# Altium project vestibular_vampire.PrjPcb (part 2 of 3)
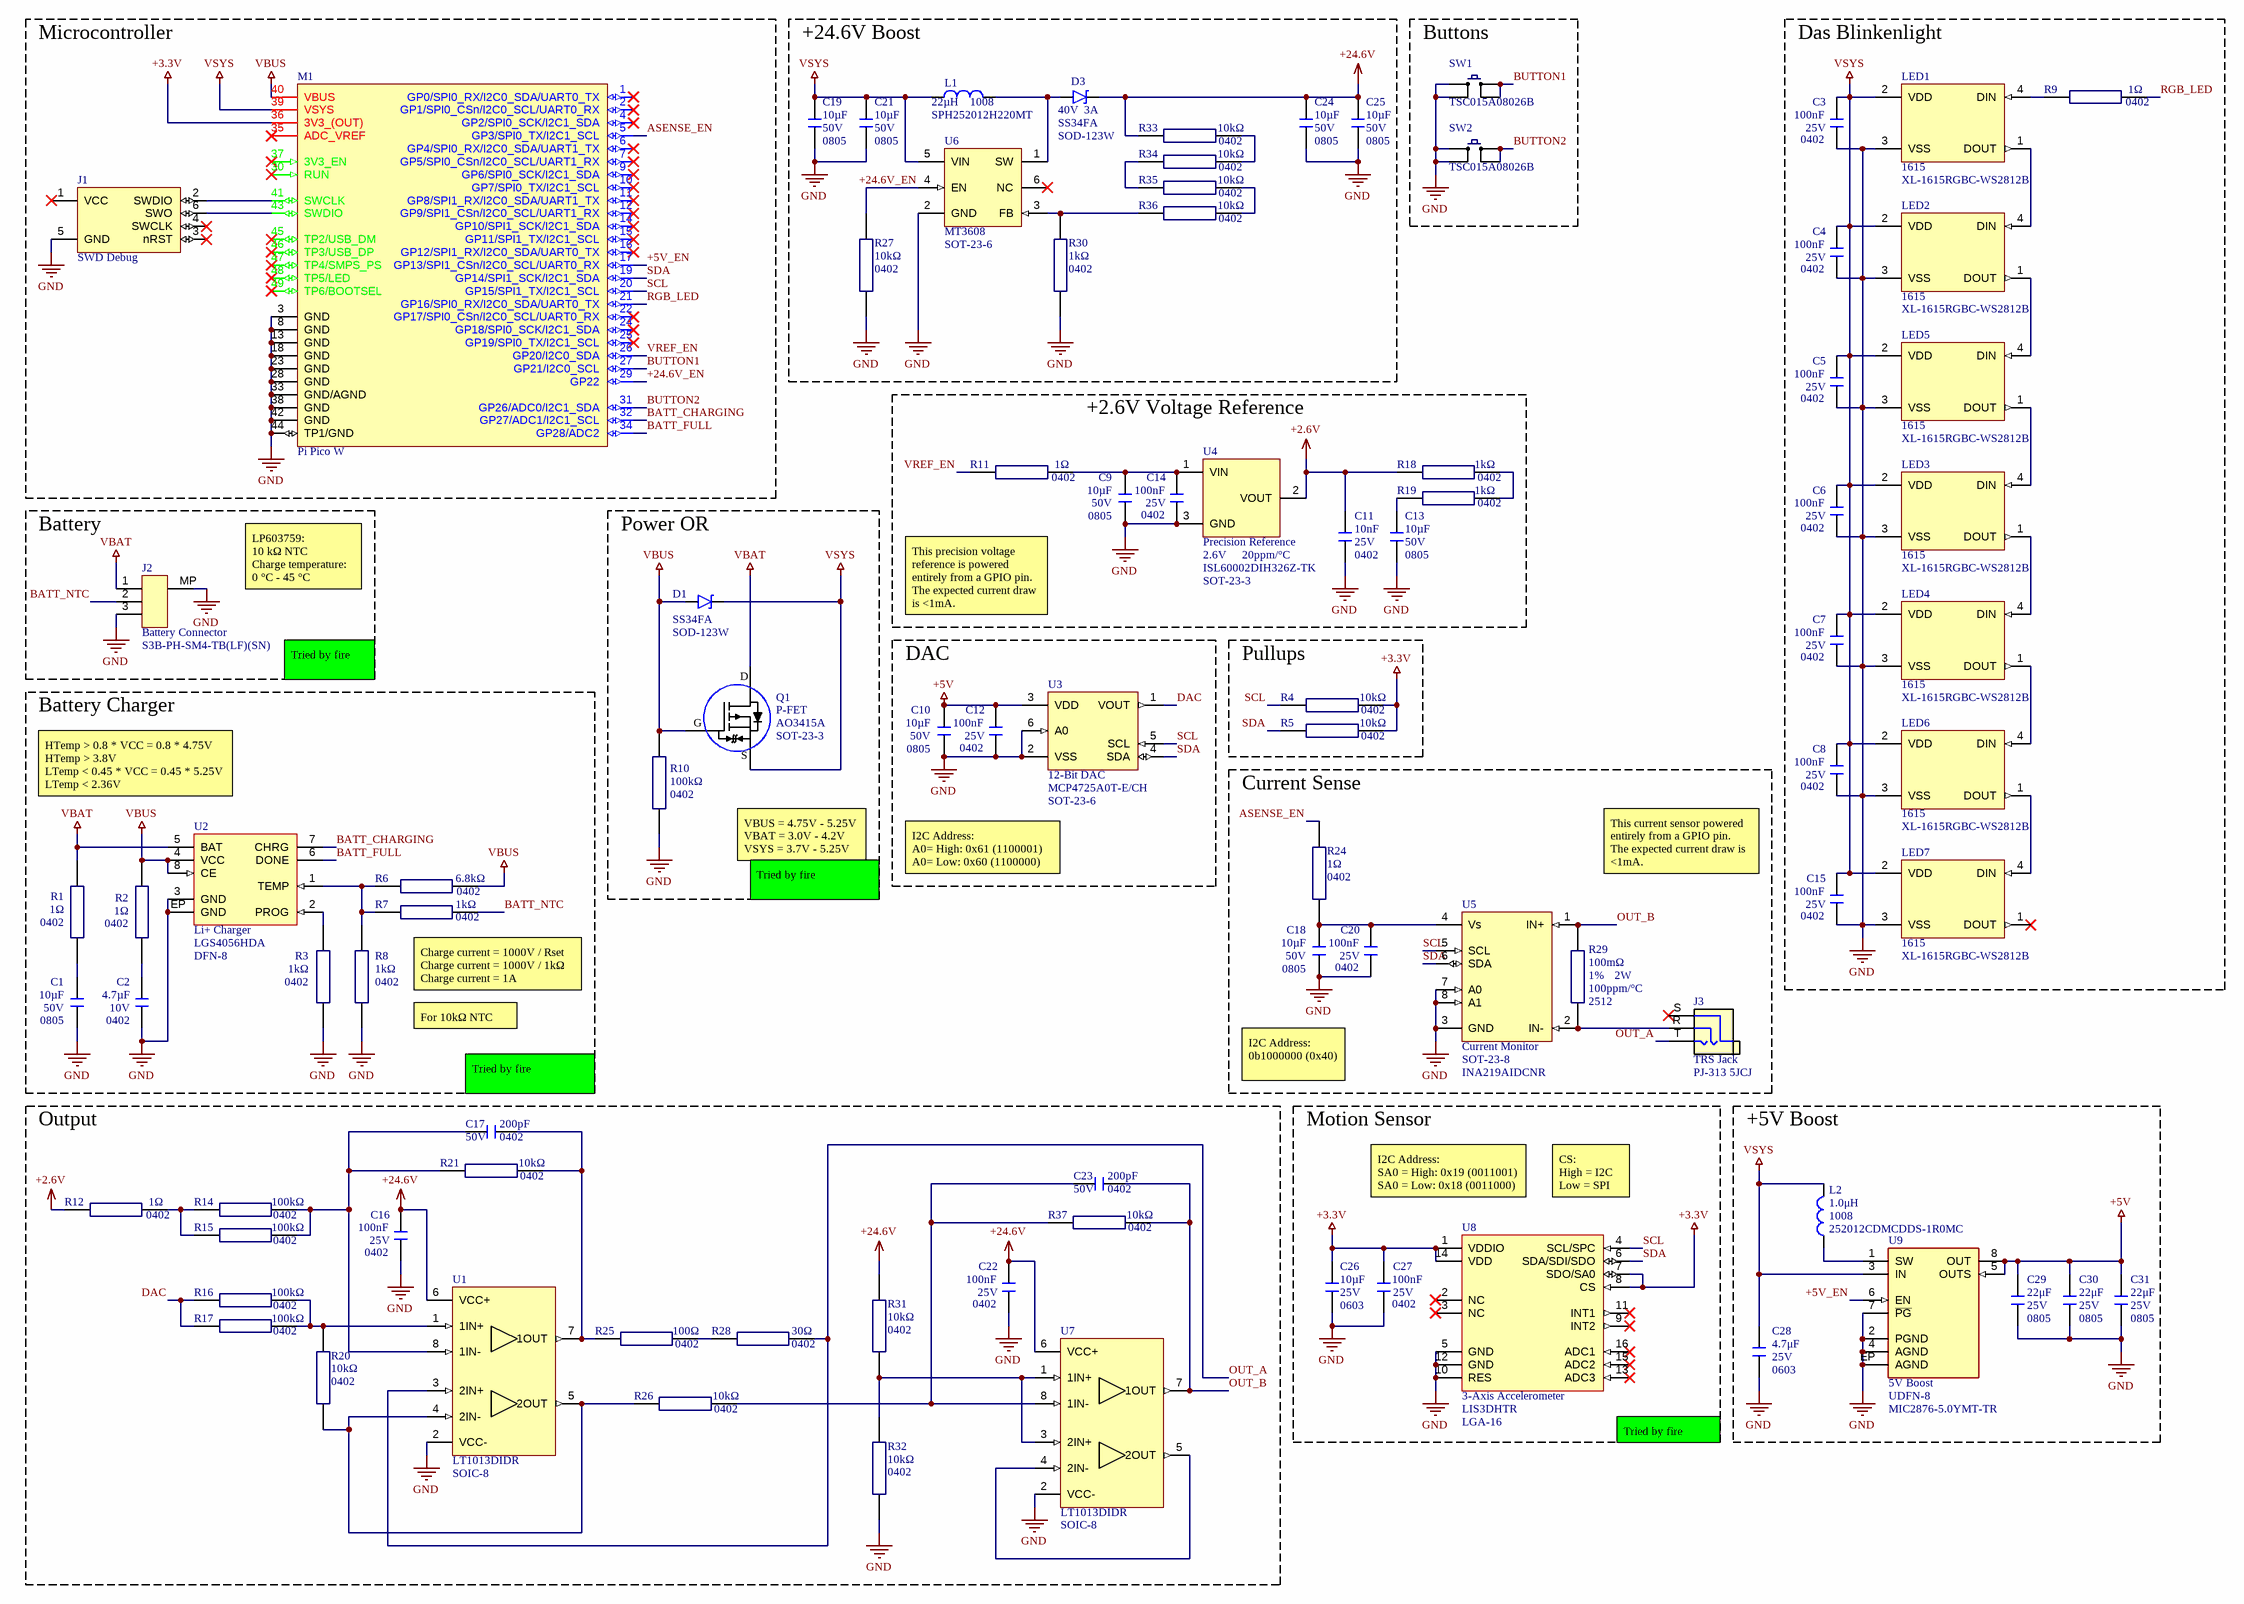
[diagram p1: vestibular_vampire.SchDoc]

## Sheet vestibular_vampire.SchDoc: Vestibular Vampire (continued)
### Library data of the parts
C1 C9 C10 C13 C18 C19 C21 C24 C25 = GRM21BR61H106KE43L: 10 μF, 50 V, X5R, 0805 Chip capacitor; Manufacturer: Murata; Manufacturer Lifecycle Status: IN PRODUCTION; Dielectric Material: Ceramic; Tolerance: 10%; Supplier 1: LCSC; Manufacturer Part Number: GRM21BR61H106KE43L; RoHS: Compliant; Category: Ceramic Capacitors; Stock 1: 4345800; Pricing 1: 10=0.4708, 10=0.0567, 10=0.514, 10=0.0644, 100=0.3794, 100=0.0457, 100=0.4142, 100=0.0519, 300=0.3327, 300=0.0401, 300=0.3631, 300=0.0455, 3000=0.2815, 3000=0.0339, 3000=0.3073, 3000=0.0385, 6000=0.2676, 6000=0.0323, 6000=0.2921, 6000=0.0366, 9000=0.2588, 9000=0.0312, 9000=0.2825, 9000=0.0354 (CNY); Dielectric: X5R; Height: 1.25mm; Length: 2mm; Lifecycle Status: Production; Material: Ceramic; Max Operating Temperature: 85°C; Min Operating Temperature: -55°C; Mounting Technology: Surface Mount; Number of Terminals: 2; REACH SVHC: Yes; Thickness: 1.25mm; Voltage Rating (DC): 50V; Width: 1.25mm; ComponentLink1URL: https://datasheet.octopart.com:443/GRM21BR61H106KE43L-Murata-datasheet-155345082.pdf?src-supplier=Newark; ComponentLink1Description: https://datasheet.octopart.com:443/GRM21BR61H106KE43L-Murata-datasheet-155345082.pdf?src-supplier=Newark; ComponentLink2URL: https://datasheet.octopart.com:443/GRM21BR61H106KE43L-Murata-datasheet-141278272.pdf?src-supplier=Geoflip; ComponentLink2Description: https://datasheet.octopart.com:443/GRM21BR61H106KE43L-Murata-datasheet-141278272.pdf?src-supplier=Geoflip; ComponentLink3URL: https://datasheet.octopart.com:443/GRM21BR61H106KE43L-Murata-datasheet-165579666.pdf?src-supplier=TME; ComponentLink3Description: https://datasheet.octopart.com:443/GRM21BR61H106KE43L-Murata-datasheet-165579666.pdf?src-supplier=TME; ComponentLink4URL: https://datasheet.octopart.com:443/GRM21BR61H106KE43L-Murata-datasheet-140707579.pdf?src-supplier=Ciiva; ComponentLink4Description: https://datasheet.octopart.com:443/GRM21BR61H106KE43L-Murata-datasheet-140707579.pdf?src-supplier=Ciiva; ComponentLink5URL: https://datasheet.octopart.com:443/GRM21BR61H106KE43L-Murata-datasheet-138744880.pdf?src-supplier=Ciiva; ComponentLink5Description: https://datasheet.octopart.com:443/GRM21BR61H106KE43L-Murata-datasheet-138744880.pdf?src-supplier=Ciiva; ComponentLink6URL: https://datasheet.octopart.com/GRM21BR61H106KE43L-Murata-datasheet-12515295.pdf; ComponentLink6Description: https://datasheet.octopart.com/GRM21BR61H106KE43L-Murata-datasheet-12515295.pdf; ComponentLink7URL: https://datasheet.octopart.com/GRM21BR61H106KE43L-Murata-datasheet-12510076.pdf; ComponentLink7Description: https://datasheet.octopart.com/GRM21BR61H106KE43L-Murata-datasheet-12510076.pdf; ComponentLink8URL: https://datasheet.octopart.com/GRM21BR61H106KE43L-Murata-datasheet-11978611.pdf; ComponentLink8Description: https://datasheet.octopart.com/GRM21BR61H106KE43L-Murata-datasheet-11978611.pdf; ComponentLink9URL: https://datasheet.octopart.com/GRM21BR61H106KE43L-Murata-datasheet-10025737.pdf; ComponentLink9Description: https://datasheet.octopart.com/GRM21BR61H106KE43L-Murata-datasheet-10025737.pdf; ComponentLink10URL: https://datasheet.octopart.com/GRM21BR61H106KE43L-Murata-datasheet-8819587.pdf; ComponentLink10Description: https://datasheet.octopart.com/GRM21BR61H106KE43L-Murata-datasheet-8819587.pdf; ComponentLink11URL: http://sigma.octopart.com:80/reach_statement/Murata-company-16.pdf?src-supplier=Compliance+Statements; ComponentLink11Description: http://sigma.octopart.com:80/reach_statement/Murata-company-16.pdf?src-supplier=Compliance+Statements; Supplier Part Number 1: C440198
C2 = CL05A475KP5NRNC: 4.7 µF, 10 V, X5R, 0402 Chip capacitor; Manufacturer: Samsung; house_part_number: C-4.7uF-0402-002; Material: Ceramic; Tolerance: 10%; RoHS: Yes; Category: Ceramic Capacitors; Min Operating Temperature: -55°C; Max Operating Temperature: 85°C; Packaging: Tape and Reel; RoHS Compliant: Yes; ComponentLink1URL: https://datasheet.ciiva.com/25724/cl05a475kp5nrnc-25724404.pdf?src-supplier=Digikey; ComponentLink1Description: https://datasheet.ciiva.com/25724/cl05a475kp5nrnc-25724404.pdf?src-supplier=Digikey; ComponentLink2URL: https://datasheet.ciiva.com/29198/458873-da-01-en-vs-kondensator-0402-29198304.pdf?src-supplier=Conrad; ComponentLink2Description: https://datasheet.ciiva.com/29198/458873-da-01-en-vs-kondensator-0402-29198304.pdf?src-supplier=Conrad; Manufacturer Part Number: CL05A475KP5NRNC; Stock: 606274; Pricing: 1=0.28, 10=0.184, 50=0.129, 100=0.1042, 500=0.0774, 1000=0.06772, 2500=0.0645, 5000=0.05966 (USD); Mounting Technology: Surface Mount; Case Code (Metric): 1005; Case Code (Imperial): 0402; Package Quantity: 1; Dielectric: X5R; Series: CL; Construction: Flat; Length: 1mm; Width: 0.02inch; Height: 0.5mm; Thickness: 0.022inch; Depth: 0.5mm; Radiation Hardening: No; Lead Free: Lead Free; Supplier Part Number 1: 1276-1480-1-ND; Supplier 1: Digikey
C3-C8 C12 C14-C16 C20 C22 C27 = GRM155R71E104KE14D: 100 nF, 25 V, X7R, 0402 Chip capacitor; Manufacturer: Murata; house_part_number: C-100nF-0402-002; Dielectric Material: Ceramic; Tolerance: 10%; Supplier 1: Digi-Key; Supplier Part Number 1: 490-10698-1-ND; RoHS: Yes; Category: Ceramic Capacitors; Pricing 1: 1=0.10000, 10=0.02700, 50=0.01460, 100=0.01190, 500=0.00848, 1000=0.00666, 2500=0.00605, 5000=0.00557 (USD); Mount: Surface Mount; Case/Package: 0402; Case Code (Metric): 1005; Weight: 0.000212oz; Min Operating Temperature: -55°C; Max Operating Temperature: 125°C; Packaging: Tape and Reel; Voltage Rating: 25V; Dielectric: X7R; Termination: SMD/SMT; Resistor Type: Ceramic; Voltage Rating (DC): 25V; Package Quantity: 10000; Length: 1mm; Width: 0.02inch; Height: 0.5mm; Thickness: 0.022inch; Depth: 0.5mm; REACH SVHC: Unknown; Lead Free: Lead Free; RoHS Compliant: Yes; ComponentLink1URL: http://www.farnell.com/datasheets/1872206.pdf?src-supplier=Farnell; ComponentLink1Description: http://www.farnell.com/datasheets/1872206.pdf?src-supplier=Farnell; ComponentLink2URL: http://components.arrow.com/part/dataview/0323_06361249?src-supplier=Arrow+Europe; ComponentLink2Description: http://components.arrow.com/part/dataview/0323_06361249?src-supplier=Arrow+Europe; ComponentLink3URL: http://uk.rs-online.com/webdocs/144c/0900766b8144c113.pdf?src-supplier=RSComponents; ComponentLink3Description: http://uk.rs-online.com/webdocs/144c/0900766b8144c113.pdf?src-supplier=RSComponents; ComponentLink4URL: http://www.farnell.com/datasheets/2048008.pdf?src-supplier=Farnell; ComponentLink4Description: http://www.farnell.com/datasheets/2048008.pdf?src-supplier=Farnell; ComponentLink5URL: http://www.mouser.com/ds/2/281/c02e-2905.pdf?src-supplier=Mouser; ComponentLink5Description: http://www.mouser.com/ds/2/281/c02e-2905.pdf?src-supplier=Mouser; ComponentLink6URL: http://www.farnell.com/datasheets/2048008.pdf?src-supplier=Newark; ComponentLink6Description: http://www.farnell.com/datasheets/2048008.pdf?src-supplier=Newark; ComponentLink7URL: https://search.murata.co.jp/Ceramy/image/img/A01X/G101/ENG/GRM155R71E104KE14-01.pdf?src-supplier=Digi-Key; ComponentLink7Description: https://search.murata.co.jp/Ceramy/image/img/A01X/G101/ENG/GRM155R71E104KE14-01.pdf?src-supplier=Digi-Key; ComponentLink8URL: http://www.farnell.com/datasheets/2048008.pdf?src-supplier=Element14; ComponentLink8Description: http://www.farnell.com/datasheets/2048008.pdf?src-supplier=Element14; ComponentLink9URL: http://psearch.en.murata.com/capacitor/product/GRM155R71E104KE14%23.pdf?src-supplier=Avnet; ComponentLink9Description: http://psearch.en.murata.com/capacitor/product/GRM155R71E104KE14%23.pdf?src-supplier=Avnet; Manufacturer Part Number: GRM155R71E104KE14D
C11 = CL05B103KA5NNNC: 10 nF, 25 V, X7R, 0402 Chip capacitor; Manufacturer: Samsung; house_part_number: C-10nF-0402-002; Tolerance: 10%; Supplier 1: Digi-Key; Supplier Part Number 1: 1276-1057-2-ND; RoHS: Yes; Category: Ceramic Capacitors; Stock 1: 2318300; Pricing 1: 10000=0.00328, 20000=0.00312, 30000=0.00297, 50000=0.00266, 100000=0.00215, 250000=0.00195 (USD); Mount: Surface Mount; Case/Package: 0402; Case Code (Metric): 1005; Contact Plating: Tin; Min Operating Temperature: -55°C; Max Operating Temperature: 125°C; Packaging: Tape and Reel; Package Quantity: 1; Dielectric: X7R; Series: CL; Construction: Flat; Length: 1mm; Width: 0.02inch; Height: 0.5mm; Thickness: 0.022inch; Depth: 0.5mm; Radiation Hardening: No; RoHS Compliant: Yes; ComponentLink1URL: https://datasheet.ciiva.com/15195/getdatasheetpartid-358612-15195635.pdf?src-supplier=Verical; ComponentLink1Description: https://datasheet.ciiva.com/15195/getdatasheetpartid-358612-15195635.pdf?src-supplier=Verical; ComponentLink2URL: https://datasheet.ciiva.com/16740/cl05b104kq5nnnc-16740683.pdf?src-supplier=Future+Electronics; ComponentLink2Description: https://datasheet.ciiva.com/16740/cl05b104kq5nnnc-16740683.pdf?src-supplier=Future+Electronics; Manufacturer Part Number: CL05B103KA5NNNC
C17 C23 = GRT1555C1H201FA02D: 200 pF, 50V, C0G, 0402 Chip capacitor; Manufacturer: Murata; Manufacturer Lifecycle Status: IN PRODUCTION; Dielectric Material: Ceramic; Temperature Coefficient: 30ppm/°C; Tolerance: 1%; Supplier 1: LCSC; Manufacturer Part Number: GRT1555C1H201FA02D; RoHS: Compliant; Category: Ceramic Capacitors; Stock 1: 4350; Pricing 1: 50=0.0995, 50=0.012, 50=0.1086, 50=0.0136, 500=0.0783, 500=0.0095, 500=0.0854, 500=0.0107, 1500=0.0666, 1500=0.0081, 1500=0.0727, 1500=0.0091, 10000=0.0593, 10000=0.0072, 10000=0.0647, 10000=0.0081, 20000=0.0534, 20000=0.0065, 20000=0.0583, 20000=0.0073, 50000=0.0505, 50000=0.0061, 50000=0.0551, 50000=0.0069 (CNY); Height: 500µm; Length: 1mm; Lifecycle Status: Production; Material: Ceramic; Max Operating Temperature: 125°C; Min Operating Temperature: -55°C; Mounting Technology: Surface Mount; Number of Terminals: 2; REACH SVHC: Yes; Thickness: 500µm; Voltage Rating (DC): 50V; Width: 500µm; ComponentLink1URL: http://sigma.octopart.com:80/reach_statement/Murata-company-16.pdf?src-supplier=Compliance+Statements; ComponentLink1Description: http://sigma.octopart.com:80/reach_statement/Murata-company-16.pdf?src-supplier=Compliance+Statements; Supplier Part Number 1: C3896876
C26 = CL10A106MA8NRNC: 10 µF, 25 V, X5R, 0603 Chip capacitor; Manufacturer: Samsung; house_part_number: C-10uF-0603-002; Tolerance: 20%; Material: 4241ConductorMaterial; RoHS: Yes; Category: Ceramic Capacitors; Case Code (Metric): 1608; Min Operating Temperature: -55°C; Max Operating Temperature: 85°C; Packaging: Cut Tape; RoHS Compliant: Yes; ComponentLink1URL: https://datasheet.ciiva.com/25766/cl10a106ma8nrnc-25766562.pdf?src-supplier=Digikey; ComponentLink1Description: https://datasheet.ciiva.com/25766/cl10a106ma8nrnc-25766562.pdf?src-supplier=Digikey; Manufacturer Part Number: CL10A106MA8NRNC; Case Code (Imperial): 0603; Stock: 632000; Pricing: 4000=0.0511, 8000=0.046, 12000=0.0434, 28000=0.0413, 100000=0.0356 (USD); Mounting Technology: Surface Mount; Series: CL; Height: 900um; Lead Free: Lead Free; Supplier Part Number 1: CL10A106MA8NRNC; Supplier 1: Arrow Electronics
C28 = C1608X5R1E475K080AC: 4.7 μF, 25 V, X7R, 0603 Chip capacitor; Manufacturer: TDK; Dielectric Material: Ceramic; Tolerance: 10%; Dielectric: X5R; Supplier: Digikey; Supplier Part Number: 445-9050-1-ND; Manufacturer Part Number: C1608X5R1E475K080AC; RoHS: Yes; Category: Ceramic Capacitors; Stock: 1983872; Pricing: 1=0.16, 10=0.104, 50=0.0732, 100=0.0592, 500=0.04396, 1000=0.03847, 4000=0.03389, 8000=0.03225 (USD); Mounting Technology: Surface Mount; Case Code (Metric): 1608; Case Code (Imperial): 0603; Weight: 7.1E-05oz; Material: Ceramic; Min Operating Temperature: -55°C; Max Operating Temperature: 85°C; Packaging: Tape and Reel; Package Quantity: 4000; Voltage Rating (DC): 25V; Termination: SMD/SMT; Series: C; Construction: Flat; Length: 1.6mm; Width: 0.031inch; Height: 0.8mm; Thickness: 0.039inch; Depth: 0.8mm; Lead Free: Lead Free; RoHS Compliant: Yes; Reach SVHC Compliant: Unknown; ComponentLink1URL: https://datasheet.ciiva.com/48671/mlcc-commercial-general-en-48671304.pdf?src-supplier=Avnet; ComponentLink1Description: https://datasheet.ciiva.com/48671/mlcc-commercial-general-en-48671304.pdf?src-supplier=Avnet; ComponentLink2URL: https://datasheet.ciiva.com/24216/mlcc-commercial-general-en-24216326.pdf?src-supplier=Mouser; ComponentLink2Description: https://datasheet.ciiva.com/24216/mlcc-commercial-general-en-24216326.pdf?src-supplier=Mouser; ComponentLink3URL: https://datasheet.ciiva.com/48587/6print-detail-pdf-phplangenpart-noc1608x5r1e475k080acimp-unit-xmhz-48587141.pdf?src-supplier=Onlinecomponents.com; ComponentLink3Description: https://datasheet.ciiva.com/48587/6print-detail-pdf-phplangenpart-noc1608x5r1e475k080acimp-unit-xmhz-48587141.pdf?src-supplier=Onlinecomponents.com
C29-C31 = GRT21BR61E226ME13L: 22 μF, 25 V, X5R, 0805 Chip capacitor; Manufacturer: Murata; Dielectric Material: Ceramic; Multilayer: Yes; Tolerance  (fill in as +-): 20%; Reference Standard: AEC-Q200; Supplier 1: Digi-Key; RoHS: Yes; Category: Ceramic Capacitors; Stock 1: 1983731; Pricing 1: 1=0.48, 10=0.338, 50=0.2558, 100=0.2228, 500=0.16508, 1000=0.14031 (USD); Mounting Technology: Surface Mount; Pins: 2; Package Shape: Rectangular; Terminal Finish: Nickel; Min Operating Temperature: -55°C; Max Operating Temperature: 85°C; JESD-609 Code: e3; Capacitor Type: Ceramic; Packaging: Tape and Reel; Tolerance (fill in as +-): 20%; Temperature Characteristics Code: X5R; Termination: Wraparound; Reach SVHC Compliant: Yes; RoHS Compliant: Yes; ComponentLink1URL: https://datasheet.ciiva.com:443/pdfs/VipMasterIC/IC/MURE/MURE-S-A0004410517/MURE-S-A0004413512-1.pdf?src-supplier=IHS+Markit; ComponentLink1Description: https://datasheet.ciiva.com:443/pdfs/VipMasterIC/IC/MURE/MURE-S-A0004410517/MURE-S-A0004413512-1.pdf?src-supplier=IHS+Markit; ComponentLink2URL: http://search.murata.co.jp/Ceramy/image/img/A01X/G101/ENG/GRT21BR61E226ME13-01.pdf?src-supplier=Digi-Key; ComponentLink2Description: http://search.murata.co.jp/Ceramy/image/img/A01X/G101/ENG/GRT21BR61E226ME13-01.pdf?src-supplier=Digi-Key; Manufacturer Part Number: GRT21BR61E226ME13L; Supplier Part Number 1: 490-12389-1-ND
D1 = SS34FA: 40 V, 3 A Schottky Rectifier, SOD-123FA; Manufacturer: ON Semiconductor / Fairchild; house_part_number: D-SCHOTTKY-3A-SOD123F-002; Max Forward Surge Current (Ifsm): 80A; Max Repetitive Reverse Voltage (Vrrm): 40V; Average Rectified Current: 3A; Element Configuration: Single; RoHS: Yes; Category: Schottky Diodes; RoHS Compliant: Yes; ComponentLink1URL: http://www.farnell.com/datasheets/2552647.pdf?src-supplier=Farnell; ComponentLink1Description: http://www.farnell.com/datasheets/2552647.pdf?src-supplier=Farnell; ComponentLink2URL: http://www.mouser.com/ds/2/149/SS34FA-1012641.pdf?src-supplier=Mouser; ComponentLink2Description: http://www.mouser.com/ds/2/149/SS34FA-1012641.pdf?src-supplier=Mouser; ComponentLink3URL: http://www.farnell.com/datasheets/2552647.pdf?src-supplier=Element14; ComponentLink3Description: http://www.farnell.com/datasheets/2552647.pdf?src-supplier=Element14; ComponentLink4URL: http://www.farnell.com/datasheets/2552647.pdf?src-supplier=Newark; ComponentLink4Description: http://www.farnell.com/datasheets/2552647.pdf?src-supplier=Newark; ComponentLink5URL: https://www.fairchildsemi.com/datasheets/SS/SS34FA.pdf?src-supplier=Digikey; ComponentLink5Description: https://www.fairchildsemi.com/datasheets/SS/SS34FA.pdf?src-supplier=Digikey; ComponentLink6URL: https://www.onsemi.com/pub/Collateral/SS36FA-D.PDF?src-supplier=Digikey; ComponentLink6Description: https://www.onsemi.com/pub/Collateral/SS36FA-D.PDF?src-supplier=Digikey; ComponentLink7URL: https://datasheet.octopart.com/SS34FA-ON-Semiconductor-datasheet-137713515.pdf?src-supplier=TME; ComponentLink7Description: https://datasheet.octopart.com/SS34FA-ON-Semiconductor-datasheet-137713515.pdf?src-supplier=TME; Manufacturer Part Number: SS34FA; Supplier 1: LCSC; Supplier Part Number 1: C719833; Supplier: Avnet; Supplier Part Number: 01AC9736; Stock: 2402; Pricing: 1=0.469, 25=0.4, 50=0.341, 100=0.281, 250=0.251 (USD); Mounting Technology: Surface Mount; Weight: 0.019g; Packaging: Cut Tape; Max Reverse Voltage (DC): 40V; Series: Automotive, AEC-Q101
D3 = SS34FA: 40 V, 3 A Schottky Rectifier, SOD-123FA; Manufacturer: ON Semiconductor / Fairchild; house_part_number: D-SCHOTTKY-3A-SOD123F-002; Max Forward Surge Current (Ifsm): 80A; Element Configuration: Single; RoHS: Yes; Category: Schottky Diodes; RoHS Compliant: Yes; ComponentLink1URL: http://www.farnell.com/datasheets/2552647.pdf?src-supplier=Farnell; ComponentLink1Description: http://www.farnell.com/datasheets/2552647.pdf?src-supplier=Farnell; ComponentLink2URL: http://www.mouser.com/ds/2/149/SS34FA-1012641.pdf?src-supplier=Mouser; ComponentLink2Description: http://www.mouser.com/ds/2/149/SS34FA-1012641.pdf?src-supplier=Mouser; ComponentLink3URL: http://www.farnell.com/datasheets/2552647.pdf?src-supplier=Element14; ComponentLink3Description: http://www.farnell.com/datasheets/2552647.pdf?src-supplier=Element14; ComponentLink4URL: http://www.farnell.com/datasheets/2552647.pdf?src-supplier=Newark; ComponentLink4Description: http://www.farnell.com/datasheets/2552647.pdf?src-supplier=Newark; ComponentLink5URL: https://www.fairchildsemi.com/datasheets/SS/SS34FA.pdf?src-supplier=Digikey; ComponentLink5Description: https://www.fairchildsemi.com/datasheets/SS/SS34FA.pdf?src-supplier=Digikey; ComponentLink6URL: https://www.onsemi.com/pub/Collateral/SS36FA-D.PDF?src-supplier=Digikey; ComponentLink6Description: https://www.onsemi.com/pub/Collateral/SS36FA-D.PDF?src-supplier=Digikey; ComponentLink7URL: https://datasheet.octopart.com/SS34FA-ON-Semiconductor-datasheet-137713515.pdf?src-supplier=TME; ComponentLink7Description: https://datasheet.octopart.com/SS34FA-ON-Semiconductor-datasheet-137713515.pdf?src-supplier=TME; Manufacturer Part Number: SS34FA; Supplier 1: LCSC; Supplier Part Number 1: C719833; Supplier: Avnet; Supplier Part Number: 01AC9736; Stock: 2402; Pricing: 1=0.469, 25=0.4, 50=0.341, 100=0.281, 250=0.251 (USD); Mounting Technology: Surface Mount; Weight: 0.019g; Packaging: Cut Tape; Max Repetitive Reverse Voltage (Vrrm): 40V; Series: Automotive, AEC-Q101
J1 = TAG_CONN_CTX: Mates with TC-2030-CTX-NL; house_part_number: type-value-case-grade
J2 = S3B-PH-SM4-TB(LF)(SN): 3-Pin JST-PH connector, 2mm pitch, right-angle SMD; Manufacturer: JST; Current Rating: 2A; Voltage Rating: 100V; Contact Resistance: 10mR; Number of Poles: 3; Insulation Resistance: 1GR; Gender: Male; Connector Type: Header; Supplier 1: LCSC; RoHS: Yes; Category: Headers and Wire Housings; Stock 1: 30540; Pricing 1: 5=0.223, 50=0.1765, 150=0.1538, 1000=0.1202, 2000=0.1152, 5000=0.1122 (USD); Mounting Technology: Surface Mount; Contact Material: Copper Alloy,Tin,Bronze,Brass; Contact Plating: Tin,Copper; Color: Natural,White; Housing Color: Beige; Housing Material: Polyamide; Material: Polyamide; Contact Shape: Square; Insulation Material: Nylon; Insulation Color: Natural; Contact Finish - Mating: TIN; Weight: 28.349523g; Min Operating Temperature: -25°C; Max Operating Temperature: 85°C; Number of Rows: 1; Voltage Rating (AC): 100V; Max Current Rating: 2A; Packaging: Tape and Reel; Number of Positions: 3; Termination: Solder; Fastening Type: Detent; Number of Contacts: 3; Working Voltage: 100V; Max Voltage Rating (AC): 100V; Max Voltage Rating (DC): 100V; Orientation: Right Angle; Contact Type: Male Pin; Voltage Rating (DC): 100V; Length: 9.9mm; Width: 5mm; Height: 9.4mm; Lead Pitch: 2mm; Pitch: 2mm; Contact Mating Length: 0.13inch; Depth: 7.6mm; Reach SVHC Compliant: No; Flammability Rating: UL94 V-0; Lead Free: 5697LeadFree; ComponentLink1URL: https://datasheet.ciiva.com/11748/0900766b80df0d9d-11748720.pdf?src-supplier=Rs; ComponentLink1Description: https://datasheet.ciiva.com/11748/0900766b80df0d9d-11748720.pdf?src-supplier=Rs; ComponentLink2URL: https://datasheet.ciiva.com/712/eph-712555.pdf?src-supplier=Digikey; ComponentLink2Description: https://datasheet.ciiva.com/712/eph-712555.pdf?src-supplier=Digikey; ComponentLink3URL: https://datasheet.ciiva.com/712/eph-712554.pdf?src-supplier=Digikey; ComponentLink3Description: https://datasheet.ciiva.com/712/eph-712554.pdf?src-supplier=Digikey; ComponentLink4URL: https://datasheet.ciiva.com/712/eph-712556.pdf?src-supplier=Digikey; ComponentLink4Description: https://datasheet.ciiva.com/712/eph-712556.pdf?src-supplier=Digikey; ComponentLink5URL: https://datasheet.ciiva.com/8052/80594-8052219.pdf?src-supplier=Element14; ComponentLink5Description: https://datasheet.ciiva.com/8052/80594-8052219.pdf?src-supplier=Element14; ComponentLink6URL: https://datasheet.ciiva.com/22693/80594-22693485.pdf?src-supplier=Element14; ComponentLink6Description: https://datasheet.ciiva.com/22693/80594-22693485.pdf?src-supplier=Element14; Supplier Part Number 1: C265101; Series: PH; Manufacturer Part Number: S3B-PH-SM4-TB(LF)(SN); house_part_number: S3B-PH-SM4-TB(LF)(SN)
J3 = PJ-313 5JCJ: 3.5mm TRS Jack; Manufacturer: SHOU HAN; Supplier 1: LCSC; Category: Uncategorized; Stock 1: 20215; Pricing 1: 5=0.5702, 5=0.068, 5=0.6225, 5=0.078, 50=0.4626, 50=0.0551, 50=0.505, 50=0.0633, 150=0.4022, 150=0.0479, 150=0.439, 150=0.0551, 1000=0.3661, 1000=0.0437, 1000=0.3996, 1000=0.0501, 5000=0.3181, 5000=0.038, 5000=0.3473, 5000=0.0436, 10000=0.3133, 10000=0.0374, 10000=0.342, 10000=0.0429 (CNY); Supplier Part Number 1: C668607; Manufacturer Part Number: PJ-313 5JCJ
L1 = SPH252012H220MT: 22 μH, .55A, 1008 Inductor; Manufacturer: Sunlord; Supplier: Digikey; Supplier Part Number: 3442-SPH252012H220MTCT-ND; RoHS: No; Category: Fixed Inductors; Stock: 945; Pricing: 1=0.35, 10=0.303, 25=0.2776, 50=0.2524, 100=0.2247, 250=0.21208, 500=0.1818, 1000=0.1616 (USD); RoHS Compliant: No; Manufacturer Part Number: SPH252012H220MT
L2 = 252012CDMCDDS-1R0MC: 1 μH, 4.2 A, 1008 Inductor; Manufacturer: Sumida; house_part_number: L-1uH-1008-002; Supplier: Digikey; Supplier Part Number 1: 308-2603-1-ND; RoHS: No; Category: Fixed Inductors; Stock: 45912; Pricing: 1=0.55, 10=0.473, 25=0.434, 50=0.3944, 100=0.3511, 250=0.33132, 500=0.284, 1000=0.25245 (USD); Manufacturer Part Number: 252012CDMCDDS-1R0MC
LED1-LED7 = XL-1615RGBC-WS2812B: 1-wire addressable RGB LED, 1615; Manufacturer: XINGLIGHT; Supplier 1: LCSC; RoHS: No; Stock 1: 257799; Pricing 1: 10=0.0454, 100=0.0362, 300=0.0315, 1000=0.0276, 4000=0.0263, 8000=0.0253 (USD); Supplier Part Number 1: C5349954; Manufacturer Part Number: XL-1615RGBC-WS2812B
M1 = pi_pico_w: Manufacturer: Raspberry Pi; Manufacturer Part Number: SC0918; Supplier 1: Digi-Key; Stock 1: 0; Supplier Part Number 1: 2648-SC0918CT-ND
Q1 = AO3415A: P-FET, 30V, 6A, SOT-23-3; Manufacturer: Alpha & Omega Semiconductor; Rds On Max: 45mΩ; Input Capacitance: 940pF; Drain to Source Voltage (Vdss): 20V; Continuous Drain Current (ID): 5A; Max Power Dissipation: 1.5W; Threshold Voltage: 8mV; Turn-Off Delay Time: 19ps; Turn-On Delay Time: 13ps; Supplier: Arrow Electronics; Supplier Part Number: AO3415A; RoHS: Yes; Category: MOSFETs; Stock: 21000; Pricing: 3000=0.3033, 6000=0.3003, 9000=0.2972, 15000=0.2942, 24000=0.2912, 30000=0.2881 (USD); Mounting Technology: Surface Mount; Pins: 3; Min Operating Temperature: -55°C; Max Operating Temperature: 150°C; Series: -; Packaging: Cut Tape; RoHS Compliant: Yes; ComponentLink1URL: https://datasheet.ciiva.com/940/ao3415-940752.pdf?src-supplier=Digikey; ComponentLink1Description: https://datasheet.ciiva.com/940/ao3415-940752.pdf?src-supplier=Digikey; ComponentLink2URL: https://datasheet.ciiva.com/940/ao3415-940753.pdf?src-supplier=Digikey; ComponentLink2Description: https://datasheet.ciiva.com/940/ao3415-940753.pdf?src-supplier=Digikey; Manufacturer Part Number: AO3415A; Supplier 1: LCSC; Supplier Part Number 1: C133233; house_part_number: AO3415A
R1 R2 R9 R11 R12 R24 = 0402WGF100KTCE: 1 Ω, 0402 Chip resistor; Manufacturer: Uniroyal; house_part_number: R-1-0402-1%-001; Supplier: LCSC; Manufacturer Part Number: 0402WGF100KTCE; RoHS: No; Stock: 596300; Pricing: 100=0.0008, 1000=0.0006, 3000=0.0005, 50000=0.0004 (USD); Supplier Part Number 1: C25086
R3 R8 R18 R19 R30 = RC0402JR-071KL: 1 kΩ, 0402 Chip resistor; Manufacturer: Yageo; house_part_number: R-1k-0402-1%-001; Tolerance: 5%; Temperature Coefficient: 100ppm/°C; Voltage Rating: 50V; Power Rating: 62.5mW; Max Power Dissipation: 63mW; Manufacturer Part Number: RC0402JR-071KL; RoHS: Yes; Category: Chip SMD Resistors; Min Operating Temperature: -55°C; Max Operating Temperature: 155°C; Resistor Type: Thick Film; Packaging: Cut Tape; Termination: SMD/SMT; RoHS Compliant: Yes; ComponentLink1URL: https://datasheet.ciiva.com/7983/1018594-7983558.pdf?src-supplier=Element14; ComponentLink1Description: https://datasheet.ciiva.com/7983/1018594-7983558.pdf?src-supplier=Element14; ComponentLink2URL: https://datasheet.ciiva.com/2452/pyu-r-int-thick-7-2452756.pdf?src-supplier=Digikey; ComponentLink2Description: https://datasheet.ciiva.com/2452/pyu-r-int-thick-7-2452756.pdf?src-supplier=Digikey; ComponentLink3URL: https://datasheet.ciiva.com/2452/pyu-r-int-thick-7-2452757.pdf?src-supplier=Digikey; ComponentLink3Description: https://datasheet.ciiva.com/2452/pyu-r-int-thick-7-2452757.pdf?src-supplier=Digikey; ComponentLink4URL: https://datasheet.ciiva.com/2452/pyu-r-int-thick-7-2452755.pdf?src-supplier=Digikey; ComponentLink4Description: https://datasheet.ciiva.com/2452/pyu-r-int-thick-7-2452755.pdf?src-supplier=Digikey; ComponentLink5URL: https://datasheet.ciiva.com/7850/1018594-7850170.pdf?src-supplier=Element14; ComponentLink5Description: https://datasheet.ciiva.com/7850/1018594-7850170.pdf?src-supplier=Element14; Stock: 15490862; Pricing: 1=0.1, 10=0.018, 50=0.0102, 100=0.0083, 500=0.00528, 1000=0.00444, 5000=0.00307 (USD); Case Code (Imperial): 0402; Case Code (Metric): 1005; Series: RC; Voltage Rating (AC): 50V; Package Quantity: 1; Number of Terminations: 2; Features: Moisture Resistant; Resistance Tolerance: 5%; Length: 0.039inch; Width: 0.02inch; Height: 0.016inch; Reach SVHC Compliant: No; Lead Free: 5697LeadFree; ComponentLink6URL: https://datasheet.ciiva.com/7850/1018594-7850171.pdf?src-supplier=Element14; ComponentLink6Description: https://datasheet.ciiva.com/7850/1018594-7850171.pdf?src-supplier=Element14; ComponentLink7URL: https://datasheet.ciiva.com/17081/pyu-rc0402-51-rohs-l-6-r-17081438.pdf?src-supplier=Future+Electronics; ComponentLink7Description: https://datasheet.ciiva.com/17081/pyu-rc0402-51-rohs-l-6-r-17081438.pdf?src-supplier=Future+Electronics; Supplier 1: Digikey; Supplier Part Number 1: 311-1.0KJRCT-ND
R4 R5 R20 R21 R26 R27 R31-R37 = RC0402FR-0710KL: 10 kΩ, 0402 Chip resistor; Manufacturer: Yageo; house_part_number: R-10k-0402-1%-001; Tolerance: 1%; Power Rating: 62.5mW; Temperature Coefficient: 100ppm/°C; Max Power Dissipation: 63mW; Voltage Rating (DC): 50V; Manufacturer Part Number: RC0402FR-0710KL; RoHS: Yes; Category: Chip SMD Resistors; Case/Package: 0402; Case Code (Metric): 1005; Min Operating Temperature: -55°C; Max Operating Temperature: 155°C; Packaging: Tape and Reel; Resistor Type: Thick Film; Number of Terminations: 2; Features: Moisture Resistant; Series: RC; Construction: Rectangular; Length: 1mm; Width: 0.5mm; Depth: 0.5mm; Military Standard: Not; Lead Free: 5697LeadFree; RoHS Compliant: Yes; ComponentLink1URL: https://datasheet.ciiva.com/12667/pyu-rc0402-51-rohs-l-6-r-12667067.pdf?src-supplier=Mouser; ComponentLink1Description: https://datasheet.ciiva.com/12667/pyu-rc0402-51-rohs-l-6-r-12667067.pdf?src-supplier=Mouser; Stock: 9380606; Pricing: 1=0.1, 10=0.015, 50=0.0088, 100=0.0073, 500=0.00488, 1000=0.00417, 5000=0.00297 (USD); Pins: 2; Termination: SMD/SMT; Voltage Rating: 50V; Resistance Tolerance: 1%; Lead Pitch: 0.2mm; Reach SVHC Compliant: Unknown; Supplier 1: Digikey; Supplier Part Number 1: 311-10.0KLRCT-ND
R6 = RC0402FR-076K8L: 6.8 kΩ, 0402 Chip resistor; Manufacturer: Yageo; house_part_number: R-6.8k-0402-1%-001; Tolerance: 1%; Temperature Coefficient: 100ppm/°C; Power Rating: 63mW; Voltage Rating: 50V; Manufacturer Part Number: RC0402FR-076K8L; RoHS: Yes; Category: Chip SMD Resistors; Case Code (Metric): 1005; Case Code (Imperial): 0402; Min Operating Temperature: -55°C; Max Operating Temperature: 155°C; Resistor Type: Thick Film; Packaging: Tape and Reel; Termination: SMD/SMT; Series: RC; Resistance Tolerance: 1%; Construction: Rectangular; Voltage Rating (AC): 50V; Length: 0.039inch; Depth: 0.5mm; Reach SVHC Compliant: No; RoHS Compliant: Yes; Lead Free: 5697LeadFree; Military Standard: Not; ComponentLink1URL: https://datasheet.ciiva.com/11819/0900766b80c66297-11819535.pdf?src-supplier=Rs; ComponentLink1Description: https://datasheet.ciiva.com/11819/0900766b80c66297-11819535.pdf?src-supplier=Rs; Supplier 1: Digikey; Stock 1: 627630; Pricing 1: 10000=0.00261, 20000=0.00231, 30000=0.00216, 50000=0.00199, 100000=0.00179 (USD); Pins: 2; Voltage Rating (DC): 50V; Package Quantity: 1; Number of Terminations: 2; Max Power Dissipation: 63mW; Features: Moisture Resistant; Technology: THICK FILM; Width: 0.02inch; Height: 0.016inch; ComponentLink2URL: https://datasheet.ciiva.com/2453/pyu-r-int-thick-7-2453500.pdf?src-supplier=Digikey; ComponentLink2Description: https://datasheet.ciiva.com/2453/pyu-r-int-thick-7-2453500.pdf?src-supplier=Digikey; ComponentLink3URL: https://datasheet.ciiva.com/2453/pyu-r-int-thick-7-2453501.pdf?src-supplier=Digikey; ComponentLink3Description: https://datasheet.ciiva.com/2453/pyu-r-int-thick-7-2453501.pdf?src-supplier=Digikey; ComponentLink4URL: https://datasheet.ciiva.com/2453/pyu-r-int-thick-7-2453499.pdf?src-supplier=Digikey; ComponentLink4Description: https://datasheet.ciiva.com/2453/pyu-r-int-thick-7-2453499.pdf?src-supplier=Digikey; ComponentLink5URL: https://datasheet.ciiva.com/12668/pyu-rc0402-51-rohs-l-6-r-12668201.pdf?src-supplier=Mouser; ComponentLink5Description: https://datasheet.ciiva.com/12668/pyu-rc0402-51-rohs-l-6-r-12668201.pdf?src-supplier=Mouser; ComponentLink6URL: https://datasheet.ciiva.com/7850/1018594-7850078.pdf?src-supplier=Element14; ComponentLink6Description: https://datasheet.ciiva.com/7850/1018594-7850078.pdf?src-supplier=Element14; ComponentLink7URL: https://datasheet.ciiva.com/7850/1018594-7850079.pdf?src-supplier=Element14; ComponentLink7Description: https://datasheet.ciiva.com/7850/1018594-7850079.pdf?src-supplier=Element14; ComponentLink8URL: https://datasheet.ciiva.com/16741/pyu-rc0402-51-rohs-l-6-r-16741018.pdf?src-supplier=Future+Electronics; ComponentLink8Description: https://datasheet.ciiva.com/16741/pyu-rc0402-51-rohs-l-6-r-16741018.pdf?src-supplier=Future+Electronics; Supplier Part Number 1: 311-6.80KLRTR-ND
R7 = RC0402JR-071KL: 1 kΩ, 0402 Chip resistor; Manufacturer: Yageo; house_part_number: R-1k-0402-1%-001; Tolerance: 5%; Temperature Coefficient: 100ppm/°C; Power Rating: 62.5mW; Voltage Rating: 50V; Max Power Dissipation: 63mW; Manufacturer Part Number: RC0402JR-071KL; RoHS: Yes; Stock: 15490862; Pricing: 1=0.1, 10=0.018, 50=0.0102, 100=0.0083, 500=0.00528, 1000=0.00444, 5000=0.00307 (USD); Category: Chip SMD Resistors; Case Code (Metric): 1005; Case Code (Imperial): 0402; Min Operating Temperature: -55°C; Max Operating Temperature: 155°C; Resistor Type: Thick Film; Packaging: Cut Tape; Package Quantity: 1; Number of Terminations: 2; Termination: SMD/SMT; Features: Moisture Resistant; Series: RC; Resistance Tolerance: 5%; Voltage Rating (AC): 50V; Length: 0.039inch; Width: 0.02inch; Height: 0.016inch; Reach SVHC Compliant: No; RoHS Compliant: Yes; Lead Free: 5697LeadFree; ComponentLink1URL: https://datasheet.ciiva.com/7983/1018594-7983558.pdf?src-supplier=Element14; ComponentLink1Description: https://datasheet.ciiva.com/7983/1018594-7983558.pdf?src-supplier=Element14; ComponentLink2URL: https://datasheet.ciiva.com/2452/pyu-r-int-thick-7-2452756.pdf?src-supplier=Digikey; ComponentLink2Description: https://datasheet.ciiva.com/2452/pyu-r-int-thick-7-2452756.pdf?src-supplier=Digikey; ComponentLink3URL: https://datasheet.ciiva.com/2452/pyu-r-int-thick-7-2452757.pdf?src-supplier=Digikey; ComponentLink3Description: https://datasheet.ciiva.com/2452/pyu-r-int-thick-7-2452757.pdf?src-supplier=Digikey; ComponentLink4URL: https://datasheet.ciiva.com/2452/pyu-r-int-thick-7-2452755.pdf?src-supplier=Digikey; ComponentLink4Description: https://datasheet.ciiva.com/2452/pyu-r-int-thick-7-2452755.pdf?src-supplier=Digikey; ComponentLink5URL: https://datasheet.ciiva.com/7850/1018594-7850170.pdf?src-supplier=Element14; ComponentLink5Description: https://datasheet.ciiva.com/7850/1018594-7850170.pdf?src-supplier=Element14; ComponentLink6URL: https://datasheet.ciiva.com/7850/1018594-7850171.pdf?src-supplier=Element14; ComponentLink6Description: https://datasheet.ciiva.com/7850/1018594-7850171.pdf?src-supplier=Element14; ComponentLink7URL: https://datasheet.ciiva.com/17081/pyu-rc0402-51-rohs-l-6-r-17081438.pdf?src-supplier=Future+Electronics; ComponentLink7Description: https://datasheet.ciiva.com/17081/pyu-rc0402-51-rohs-l-6-r-17081438.pdf?src-supplier=Future+Electronics; Supplier 1: Digikey; Supplier Part Number 1: 311-1.0KJRCT-ND
R10 R14-R17 = RC0402FR-07100KL: 100 kΩ, 0402 Chip resistor; Manufacturer: Yageo; house_part_number: R-100k-0402-1%-001; Tolerance: 1%; Temperature Coefficient: 100ppm/°C; Power Rating: 63mW; Voltage Rating: 50V; Manufacturer Part Number: RC0402FR-07100KL; RoHS: Yes; Category: Chip SMD Resistors; Stock: 44340000; Pricing: 10000=0.0012, 50000=0.0011, 100000=0.0011, 250000=0.001, 300000=0.001, 500000=0.001, 750000=0.001, 1500000=0.0009, 2000000=0.0009 (USD); Case Code (Metric): 1005; Case Code (Imperial): 0402; Min Operating Temperature: -55°C; Max Operating Temperature: 155°C; Resistor Type: Thick Film; Packaging: Tape and Reel; Package Quantity: 1; Number of Terminations: 2; Termination: SMD/SMT; Max Power Dissipation: 63mW; Features: Moisture Resistant; Series: RC; Resistance Tolerance: 1%; Construction: Rectangular; Technology: THICK FILM; Voltage Rating (AC): 50V; Length: 0.039inch; Width: 0.02inch; Height: 0.016inch; Depth: 0.5mm; Reach SVHC Compliant: No; RoHS Compliant: Yes; Lead Free: 5697LeadFree; Military Standard: Not; ComponentLink1URL: https://datasheet.ciiva.com/11819/0900766b80c66297-11819452.pdf?src-supplier=Rs; ComponentLink1Description: https://datasheet.ciiva.com/11819/0900766b80c66297-11819452.pdf?src-supplier=Rs; ComponentLink2URL: https://datasheet.ciiva.com/22747/1018594-22747509.pdf?src-supplier=Element14; ComponentLink2Description: https://datasheet.ciiva.com/22747/1018594-22747509.pdf?src-supplier=Element14; ComponentLink3URL: https://datasheet.ciiva.com/2453/pyu-r-int-thick-7-2453362.pdf?src-supplier=Digikey; ComponentLink3Description: https://datasheet.ciiva.com/2453/pyu-r-int-thick-7-2453362.pdf?src-supplier=Digikey; ComponentLink4URL: https://datasheet.ciiva.com/12667/pyu-rc0402-51-rohs-l-6-r-12667930.pdf?src-supplier=Mouser; ComponentLink4Description: https://datasheet.ciiva.com/12667/pyu-rc0402-51-rohs-l-6-r-12667930.pdf?src-supplier=Mouser; ComponentLink5URL: https://datasheet.ciiva.com/15189/getdatasheetpartid-323696-15189334.pdf?src-supplier=Verical; ComponentLink5Description: https://datasheet.ciiva.com/15189/getdatasheetpartid-323696-15189334.pdf?src-supplier=Verical; ComponentLink6URL: https://datasheet.ciiva.com/2453/pyu-r-int-thick-7-2453363.pdf?src-supplier=Digikey; ComponentLink6Description: https://datasheet.ciiva.com/2453/pyu-r-int-thick-7-2453363.pdf?src-supplier=Digikey; ComponentLink7URL: https://datasheet.ciiva.com/2453/pyu-r-int-thick-7-2453361.pdf?src-supplier=Digikey; ComponentLink7Description: https://datasheet.ciiva.com/2453/pyu-r-int-thick-7-2453361.pdf?src-supplier=Digikey; Supplier 1: Future Electronics; Supplier Part Number 1: 6468466
R25 = RMCF0402FT100R: 100 Ω, 0402 Chip resistor; Manufacturer: Stackpole Electronics; house_part_number: R-100-0402-1%-001; Power Rating: 62.5mW; Tolerance: 1%; Max Power Dissipation: 63mW; Temperature Coefficient: 100ppm/°C; Supplier 1: Digi-Key; Supplier Part Number 1: RMCF0402FT100RCT-ND; RoHS: Yes; Category: Chip SMD Resistors; Stock 1: 188482; Pricing 1: 1=0.10000, 10=0.01300, 100=0.00530, 1000=0.00238, 2500=0.00207, 5000=0.00171 (USD); Mount: Surface Mount; Case/Package: 0402; Case Code (Metric): 1005; Contact Plating: Tin,Matte; Min Operating Temperature: -55°C; Max Operating Temperature: 155°C; Packaging: Tape and Reel; Resistor Type: Thick Film; Number of Terminations: 2; Features: Automotive AEC-Q200; Series: RMCF; Construction: Rectangular; Length: 1mm; Width: 0.02inch; Height: 0.016inch; Depth: 0.5mm; Military Standard: Not; Lead Free: Lead Free; RoHS Compliant: Yes; ComponentLink1URL: http://components.arrow.com/part/dataview/50497758S7215546N1174?src-supplier=Arrow+Electronics; ComponentLink1Description: http://components.arrow.com/part/dataview/50497758S7215546N1174?src-supplier=Arrow+Electronics; ComponentLink2URL: https://www.seielect.com/catalog/sei-rmcf_rmcp.pdf?src-supplier=Digi-Key; ComponentLink2Description: https://www.seielect.com/catalog/sei-rmcf_rmcp.pdf?src-supplier=Digi-Key; ComponentLink3URL: https://www.seielect.com/Catalog/SEI-RMCF_RMCP.pdf?src-supplier=Avnet; ComponentLink3Description: https://www.seielect.com/Catalog/SEI-RMCF_RMCP.pdf?src-supplier=Avnet; ComponentLink4URL: https://www.verical.com/server-webapp/html/getDatasheet?partID=368652&src-supplier=Verical; ComponentLink4Description: https://www.verical.com/server-webapp/html/getDatasheet?partID=368652&src-supplier=Verical; ComponentLink5URL: https://www.seielect.com/Catalog/SEI-RMCF_RMCP.pdf?src-supplier=Avnet+Asia; ComponentLink5Description: https://www.seielect.com/Catalog/SEI-RMCF_RMCP.pdf?src-supplier=Avnet+Asia; Manufacturer Part Number: RMCF0402FT100R
R28 = RC0402FR-0730RL: 30 Ω, 1%, 0402 Chip resistor; Manufacturer: Yageo Group; Power Dissipation: 62.5mW; Power Rating: 63mW; Temperature Coefficient: 100ppm/°C; Voltage Rating: 50V; Supplier 1: DigiKey; Manufacturer Part Number: RC0402FR-0730RL; RoHS: Compliant; Category: Chip SMD Resistors; Stock 1: 283925; Pricing 1: 1=0.1, 10=0.009, 25=0.0068, 50=0.004, 100=0.0033 (USD); Case Code (Imperial): 0402; Case Code (Metric): 1005; China RoHS: Non-Compliant; Composition: Thick Film; Contact Plating: Tin; Depth: 500µm; Height: 350µm; Lead Free: Lead Free; Length: 1mm; Lifecycle Status: Production; Max Operating Temperature: 155°C; Military Standard: Not; Min Operating Temperature: -55°C; Mounting Technology: Surface Mount; Pins: 2; Number of Terminals: 2; Packaging: Cut Tape; REACH SVHC: Yes; Schedule B: 8533210045, 8533210045|8533210045|8533210045|8533210045|8533210045; Termination: SMD/SMT; Tolerance: 1%; Voltage Rating (DC): 50V; Width: 500µm; Working Voltage: 50V; ComponentLink1URL: https://datasheet.octopart.com:443/RC0402FR-0730RL-Yageo-datasheet-175887523.pdf?src-supplier=Newark; ComponentLink1Description: https://datasheet.octopart.com:443/RC0402FR-0730RL-Yageo-datasheet-175887523.pdf?src-supplier=Newark; ComponentLink2URL: https://datasheet.octopart.com:443/RC0402FR-0730RL-Yageo-datasheet-8324527.pdf?src-supplier=Newark; ComponentLink2Description: https://datasheet.octopart.com:443/RC0402FR-0730RL-Yageo-datasheet-8324527.pdf?src-supplier=Newark; ComponentLink3URL: https://datasheet.octopart.com:443/RC0402FR-0730RL-Yageo-datasheet-103092701.pdf?src-supplier=Upverter; ComponentLink3Description: https://datasheet.octopart.com:443/RC0402FR-0730RL-Yageo-datasheet-103092701.pdf?src-supplier=Upverter; ComponentLink4URL: https://datasheet.octopart.com:443/RC0402FR-0730RL-Yageo-Group-datasheet-189192902.pdf?src-supplier=TME; ComponentLink4Description: https://datasheet.octopart.com:443/RC0402FR-0730RL-Yageo-Group-datasheet-189192902.pdf?src-supplier=TME; ComponentLink5URL: https://datasheet.octopart.com:443/RC0402FR-0730RL-Yageo-datasheet-10408619.pdf?src-supplier=element14+APAC; ComponentLink5Description: https://datasheet.octopart.com:443/RC0402FR-0730RL-Yageo-datasheet-10408619.pdf?src-supplier=element14+APAC; ComponentLink6URL: https://datasheet.octopart.com:443/RC0402FR-0730RL-Yageo-datasheet-62067350.pdf?src-supplier=element14+APAC; ComponentLink6Description: https://datasheet.octopart.com:443/RC0402FR-0730RL-Yageo-datasheet-62067350.pdf?src-supplier=element14+APAC; ComponentLink7URL: https://datasheet.octopart.com:443/RC0402FR-0730RL-Yageo-datasheet-176638170.pdf?src-supplier=JRH+Electronics; ComponentLink7Description: https://datasheet.octopart.com:443/RC0402FR-0730RL-Yageo-datasheet-176638170.pdf?src-supplier=JRH+Electronics; ComponentLink8URL: https://datasheet.octopart.com:443/RC0402FR-0730RL-Yageo-datasheet-164759695.pdf?src-supplier=Future+Electronics; ComponentLink8Description: https://datasheet.octopart.com:443/RC0402FR-0730RL-Yageo-datasheet-164759695.pdf?src-supplier=Future+Electronics; ComponentLink9URL: https://datasheet.octopart.com:443/RC0402FR-0730RL-Yageo-datasheet-137700087.pdf?src-supplier=Future+Electronics; ComponentLink9Description: https://datasheet.octopart.com:443/RC0402FR-0730RL-Yageo-datasheet-137700087.pdf?src-supplier=Future+Electronics; ComponentLink10URL: https://datasheet.octopart.com:443/RC0402FR-0730RL-Yageo-datasheet-12531192.pdf?src-supplier=Future+Electronics; ComponentLink10Description: https://datasheet.octopart.com:443/RC0402FR-0730RL-Yageo-datasheet-12531192.pdf?src-supplier=Future+Electronics; ComponentLink11URL: https://datasheet.octopart.com/RC0402FR-0730RL-Yageo-datasheet-73766026.pdf; ComponentLink11Description: https://datasheet.octopart.com/RC0402FR-0730RL-Yageo-datasheet-73766026.pdf; ComponentLink12URL: http://sigma.octopart.com:80/rohs_statement/Yageo-company-2.pdf?src-supplier=Compliance+Statements; ComponentLink12Description: http://sigma.octopart.com:80/rohs_statement/Yageo-company-2.pdf?src-supplier=Compliance+Statements; ComponentLink13URL: http://sigma.octopart.com:80/conflict_mineral_statement/Yageo-company-3.pdf?src-supplier=Compliance+Statements; ComponentLink13Description: http://sigma.octopart.com:80/conflict_mineral_statement/Yageo-company-3.pdf?src-supplier=Compliance+Statements; Supplier Part Number 1: 311-30LRCT-ND
R29 = PT2512FK-7W0R1L: 100 mΩ, 1%, 100ppm/℃, 2W, 2512 Chip Resistor; Manufacturer: Yageo Group; Working Voltage: 447mV; Supplier 1: DigiKey; Manufacturer Part Number: PT2512FK-7W0R1L; RoHS: Compliant; Category: Chip SMD Resistors; Pricing 1: 1=0.71, 10=0.461, 25=0.3924, 50=0.3494, 100=0.313, 250=0.27296, 500=0.2479, 1000=0.22662 (USD); Composition: Thick Film; Features: Automotive AEC-Q200, Moisture Resistant; Height: 550µm; Length: 6.35mm; Lifecycle Status: Production; Max Operating Temperature: 155°C; Max Power Dissipation: 2W; Min Operating Temperature: -55°C; Mounting Technology: Surface Mount; Number of Terminals: 2; Number of Terminations: 2; REACH SVHC: Yes; Width: 3.2mm; ComponentLink1URL: https://datasheet.octopart.com:443/PT2512FK-7W0R1L-Yageo-datasheet-182189530.pdf?src-supplier=IHS; ComponentLink1Description: https://datasheet.octopart.com:443/PT2512FK-7W0R1L-Yageo-datasheet-182189530.pdf?src-supplier=IHS; ComponentLink2URL: https://datasheet.octopart.com:443/PT2512FK-7W0R1L-Yageo-datasheet-137700561.pdf?src-supplier=Farnell; ComponentLink2Description: https://datasheet.octopart.com:443/PT2512FK-7W0R1L-Yageo-datasheet-137700561.pdf?src-supplier=Farnell; ComponentLink3URL: https://datasheet.octopart.com/PT2512FK-7W0R1L-Yageo-datasheet-86814862.pdf; ComponentLink3Description: https://datasheet.octopart.com/PT2512FK-7W0R1L-Yageo-datasheet-86814862.pdf; ComponentLink4URL: http://sigma.octopart.com:80/rohs_statement/Yageo-company-2.pdf?src-supplier=Compliance+Statements; ComponentLink4Description: http://sigma.octopart.com:80/rohs_statement/Yageo-company-2.pdf?src-supplier=Compliance+Statements; ComponentLink5URL: http://sigma.octopart.com:80/conflict_mineral_statement/Yageo-company-3.pdf?src-supplier=Compliance+Statements; ComponentLink5Description: http://sigma.octopart.com:80/conflict_mineral_statement/Yageo-company-3.pdf?src-supplier=Compliance+Statements; Supplier Part Number 1: 13-PT2512FK-7W0R1LCT-ND
SW1 SW2 = TSC015A08026B: Tactile switch, SPST; house_part_number: SW-TAC-4.5-8-260gf; Mechanical Life: 100000Cycles; Illumination Type: Non-Illuminated; Switch Function: Off-Mom; Actuator Type: Standard; Operating Force: 260gf; Switch Travel: 0.25mm; Ratings: IP40; RoHS: No; Category: Tactile Switches; Stock 1: 68566; Pricing 1: 1=0.13000, 10=0.12700, 25=0.12080, 100=0.10970, 250=0.10308, 500=0.09432, 1000=0.07897 (USD); Mount: Surface Mount; Min Operating Temperature: -20°C; Max Operating Temperature: 70°C; Throw Configuration: SPST; Packaging: Tape and Reel; Termination: Gull Wing; ComponentLink1URL: https://www.ckswitches.com/media/2567/pts647.pdf?src-supplier=Digi-Key; ComponentLink1Description: https://www.ckswitches.com/media/2567/pts647.pdf?src-supplier=Digi-Key; Height: 8mm; Manufacturer Part Number: TSC015A08026B